# EAGLE schematic Titan (EAGLE 9.6.2)
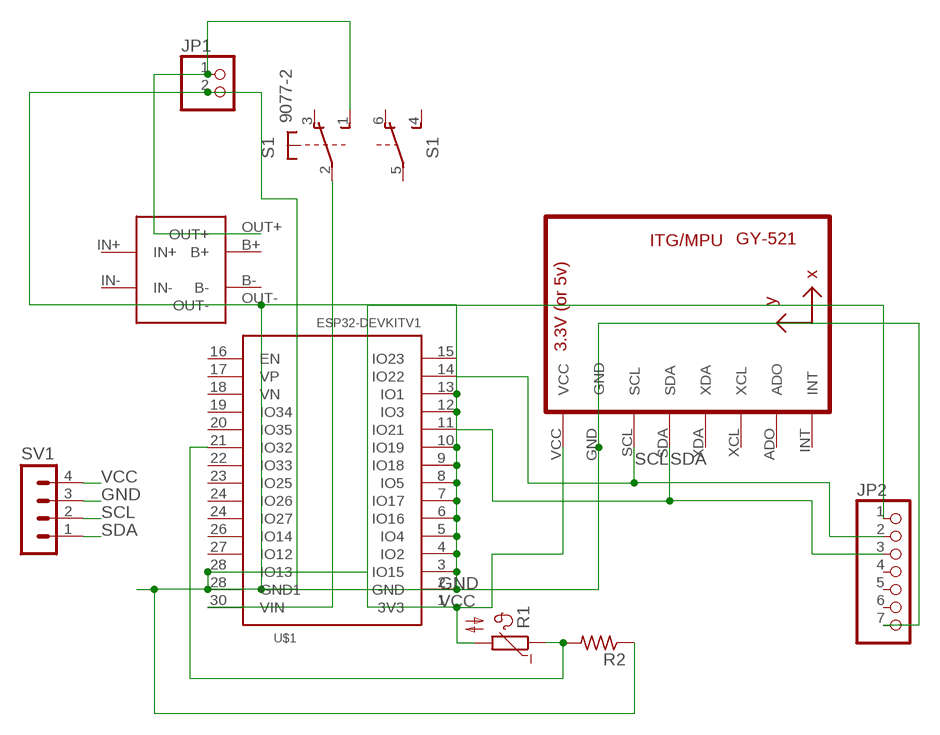
[diagram p0: schematic, sheet 1]

## Parts
JP1  PINHD-1X2  [1X02]
JP2  PINHD-1X7  [1X07]
R1  NTC640  [P640]
R2  R-US_0207/10  [0207/10]
S1  9077-2  [9077-2]
SV1  MA04-1  [MA04-1]
U1  GY-521MPU6050  [GY-521]
U$1  ESP32DEVKITV1  [ESP32-DEVKITV1]
U$3  TP4056  [TP4056]

## Nets
GND: JP1.2 JP2.7 R2.1 SV1.3 U1.GND U$1.2(GND) U$1.3(IO15) U$1.4(IO2) U$1.5(IO4) U$1.6(IO16) U$1.7(IO17) U$1.8(IO5) U$1.9(IO18) U$1.10(IO19) U$1.12(IO3) U$1.13(IO1) U$1.28(GND1) U$1.28(IO13) U$3.OUT-
N$1: U1.INT U$1.15(IO23)
N$6: JP1.1 S1.1(1:S) U$3.OUT+
N$9: R1.1 R2.2 U$1.21(IO32)
N$11: S1.2(1:P) U$1.30(VIN)
SCL: JP2.2 SV1.2 U1.SCL U$1.14(IO22)
SDA: JP2.3 SV1.1 U1.SDA U$1.11(IO21)
VCC: JP2.1 R1.2 SV1.4 U1.VCC U$1.1(3V3)
Unconnected: JP2.4 JP2.5 JP2.6 S1.3(1:O) S1.4(2:S) S1.5(2:P) S1.6(2:O) U1.ADO U1.XCL U1.XDA U$1.16(EN) U$1.17(VP) U$1.18(VN) U$1.19(IO34) U$1.20(IO35) U$1.22(IO33) U$1.23(IO25) U$1.24(IO26) U$1.24(IO27) U$1.26(IO14) U$1.27(IO12) U$3.B+ U$3.B- U$3.IN+ U$3.IN-

## Library data of the parts
JP1 = pinhead:PINHD-1X2: PIN HEADER
JP2 = pinhead:PINHD-1X7: PIN HEADER
R1 = ptc-ntc:NTC640: PHILIPS NTC; OC_FARNELL: unknown; OC_NEWARK: unknown
R2 = rcl:R-US_: RESISTOR, American symbol; SPICEPREFIX: R
S1 = switch-misc:9077-2: MARQUARDT SWITCH 9077.0200 Distributor: Buerklin <https://www.buerklin.com/default.asp?event=ShowArtikel%2812G2822%29&l=d&jump=ArtNr_12G2822>
SV1 = con-lstb:MA04-1: PIN HEADER; OC_FARNELL: unknown; OC_NEWARK: unknown
U1 = gy-521:GY-521
U$1 = ESP32-DEVKITV1:ESP32DEVKITV1
U$3 = 32teeth - TP4056 Module:TP4056